# EAGLE design PCB_MULTI_PUMP (EAGLE 9.5.2)
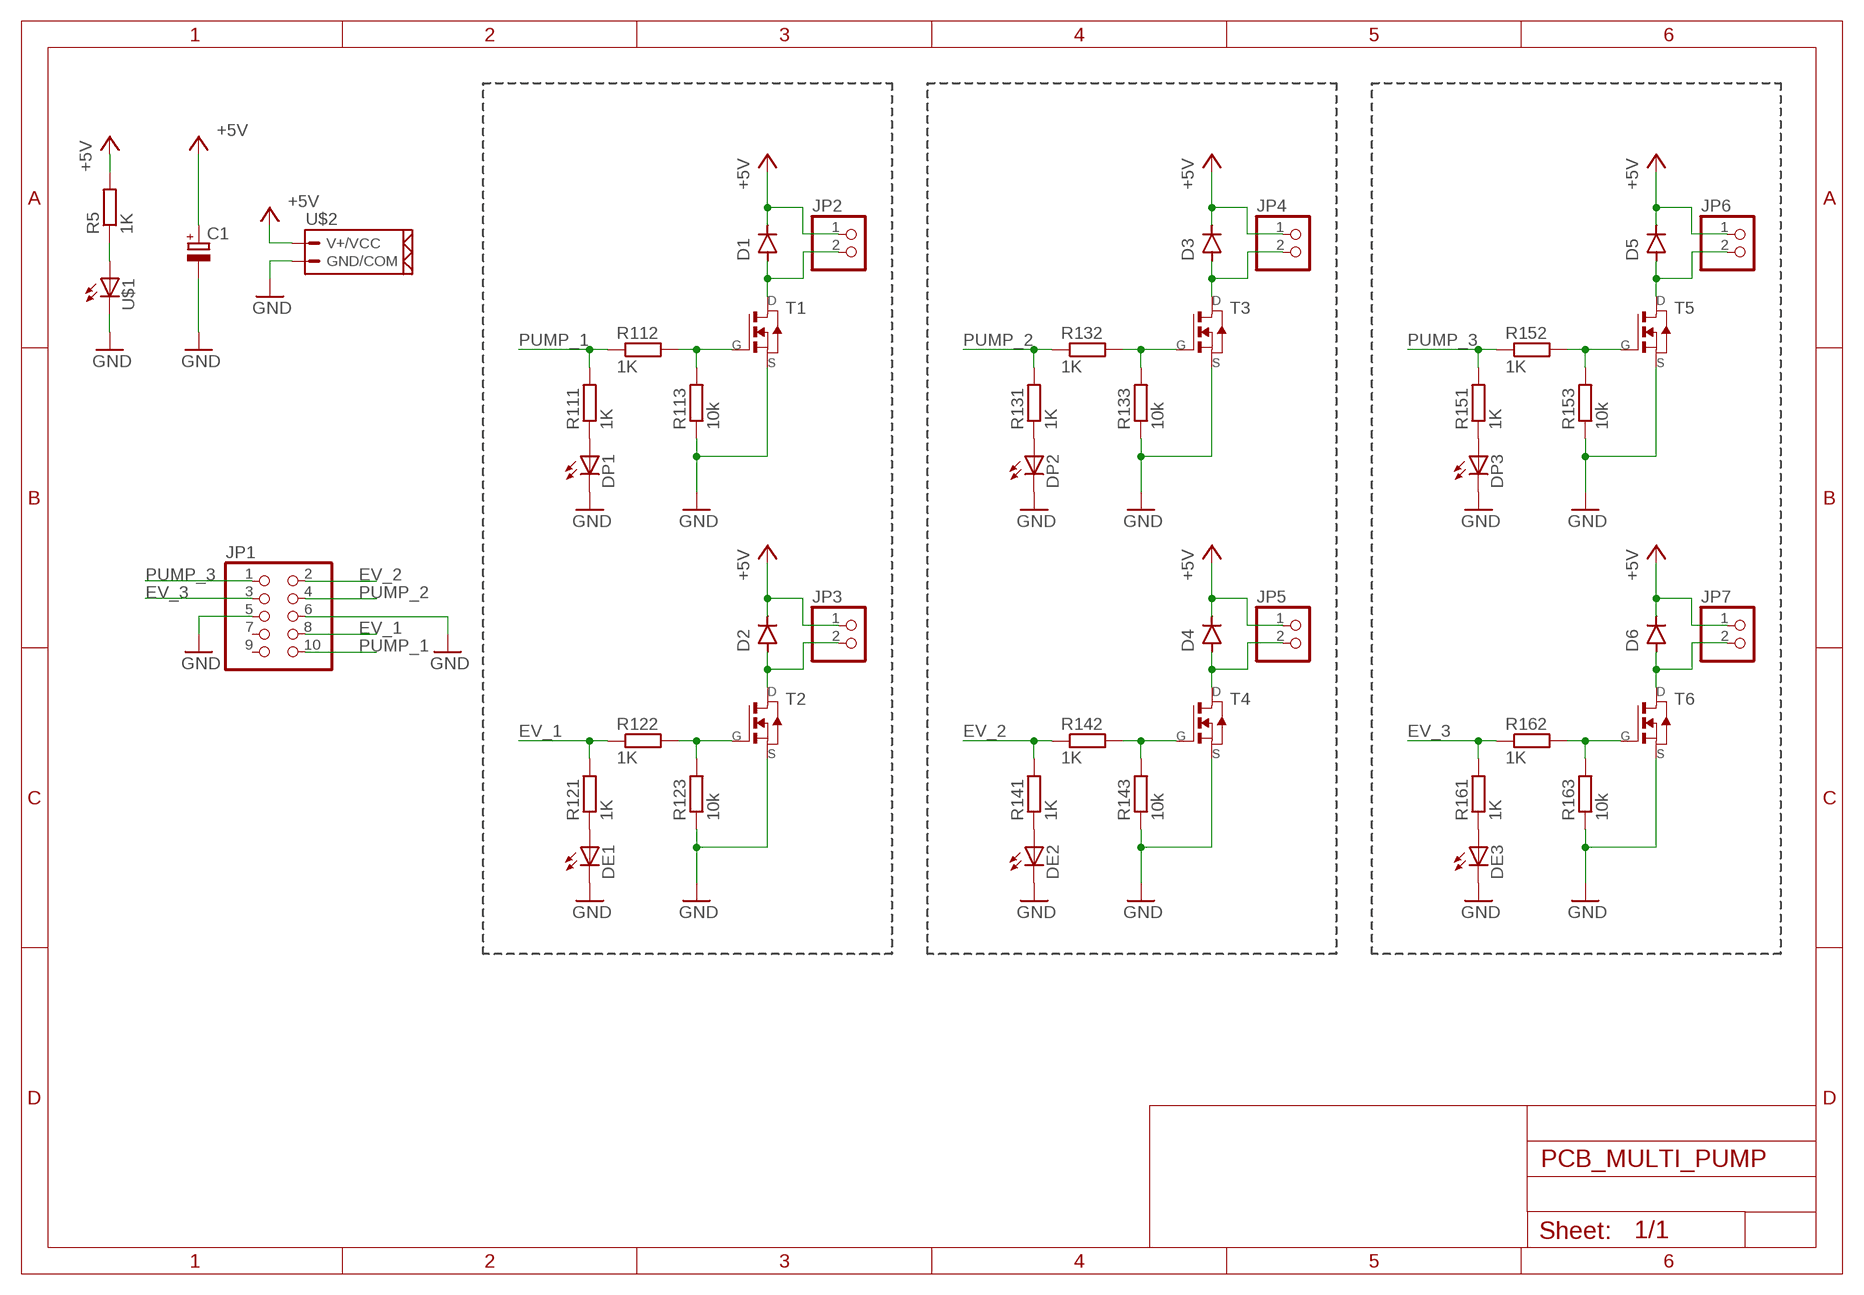
[diagram p0: schematic, sheet 1]

## Parts
C1  CPOL-EUE5-10.5  [E5-10,5]
D1  GF1  [SMA-DO214AC]
D2  GF1  [SMA-DO214AC]
D3  GF1  [SMA-DO214AC]
D4  GF1  [SMA-DO214AC]
D5  GF1  [SMA-DO214AC]
D6  GF1  [SMA-DO214AC]
DE1  LEDFAB1206  [LED1206FAB]
DE2  LEDFAB1206  [LED1206FAB]
DE3  LEDFAB1206  [LED1206FAB]
DP1  LEDFAB1206  [LED1206FAB]
DP2  LEDFAB1206  [LED1206FAB]
DP3  LEDFAB1206  [LED1206FAB]
JP1  PINHD-2X05_2.54-SMD  [2X05SMD]
JP2  PINHD-1X02_2.54-SMD-90°  [1X02SMD/90]
JP3  PINHD-1X02_2.54-SMD-90°  [1X02SMD/90]
JP4  PINHD-1X02_2.54-SMD-90°  [1X02SMD/90]
JP5  PINHD-1X02_2.54-SMD-90°  [1X02SMD/90]
JP6  PINHD-1X02_2.54-SMD-90°  [1X02SMD/90]
JP7  PINHD-1X02_2.54-SMD-90°  [1X02SMD/90]
R5  1K  R-EU_R1206  [R1206]
R111  1K  R-EU_R1206  [R1206]
R112  1K  R-EU_R1206  [R1206]
R113  10k  R-EU_R1206  [R1206]
R121  1K  R-EU_R1206  [R1206]
R122  1K  R-EU_R1206  [R1206]
R123  10k  R-EU_R1206  [R1206]
R131  1K  R-EU_R1206  [R1206]
R132  1K  R-EU_R1206  [R1206]
R133  10k  R-EU_R1206  [R1206]
R141  1K  R-EU_R1206  [R1206]
R142  1K  R-EU_R1206  [R1206]
R143  10k  R-EU_R1206  [R1206]
R151  1K  R-EU_R1206  [R1206]
R152  1K  R-EU_R1206  [R1206]
R153  10k  R-EU_R1206  [R1206]
R161  1K  R-EU_R1206  [R1206]
R162  1K  R-EU_R1206  [R1206]
R163  10k  R-EU_R1206  [R1206]
T1  NMOSFETSOT23  [SOT-23]
T2  NMOSFETSOT23  [SOT-23]
T3  NMOSFETSOT23  [SOT-23]
T4  NMOSFETSOT23  [SOT-23]
T5  NMOSFETSOT23  [SOT-23]
T6  NMOSFETSOT23  [SOT-23]
U$1  LEDFAB1206  [LED1206FAB]
U$2  CONN_02_PUI  [NSK396-2C]

## Nets
+5V: C1.+ D1.K(C) D2.K(C) D3.K(C) D4.K(C) D5.K(C) D6.K(C) JP2.1 JP3.1 JP4.1 JP5.1 JP6.1 JP7.1 R5.2 U$2.P$2(V+/VCC)
EV_1: JP1.8 R121.2 R122.1
EV_2: JP1.2 R141.2 R142.1
EV_3: JP1.3 R161.2 R162.1
GND: C1.- DE1.2(C) DE2.2(C) DE3.2(C) DP1.2(C) DP2.2(C) DP3.2(C) JP1.5 JP1.6 R113.1 R123.1 R133.1 R143.1 R153.1 R163.1 T1.2(S) T2.2(S) T3.2(S) T4.2(S) T5.2(S) T6.2(S) U$1.2(C) U$2.P$1(GND/COM)
N$1: D2.A JP3.2 T2.1(D)
N$2: D1.A JP2.2 T1.1(D)
N$3: R112.2 R113.2 T1.3(G)
N$4: R122.2 R123.2 T2.3(G)
N$5: R5.1 U$1.1(A)
N$6: DP1.1(A) R111.1
N$7: DE1.1(A) R121.1
N$8: D3.A JP4.2 T3.1(D)
N$9: R132.2 R133.2 T3.3(G)
N$10: D4.A JP5.2 T4.1(D)
N$11: R142.2 R143.2 T4.3(G)
N$12: DP2.1(A) R131.1
N$13: DE2.1(A) R141.1
N$14: D5.A JP6.2 T5.1(D)
N$15: R152.2 R153.2 T5.3(G)
N$16: D6.A JP7.2 T6.1(D)
N$17: R162.2 R163.2 T6.3(G)
N$18: DP3.1(A) R151.1
N$19: DE3.1(A) R161.1
PUMP_1: JP1.10 R111.2 R112.1
PUMP_2: JP1.4 R131.2 R132.1
PUMP_3: JP1.1 R151.2 R152.1
Unconnected: JP1.7 JP1.9

## Library data of the parts
C1 = rcl:CPOL-EU: POLARIZED CAPACITOR, European symbol; SPICEPREFIX: C
D1-D6 = diode:GF1: DIODE
DE1-DE3 DP1-DP3 U$1 = fab:LED: LED
JP1 = pinhead-2:PINHD-2X05: PIN HEADER
JP2-JP7 = pinhead-2:PINHD-1X02: PIN HEADER
R5 R111-R113 R121-R123 R131-R133 R141-R143 R151-R153 R161-R163 = rcl:R-EU_: RESISTOR, European symbol; SPICEPREFIX: R
T1-T6 = fab:NMOSFET: MOS FET
U$2 = OPENBOT:CONN_02_PUI

## Board
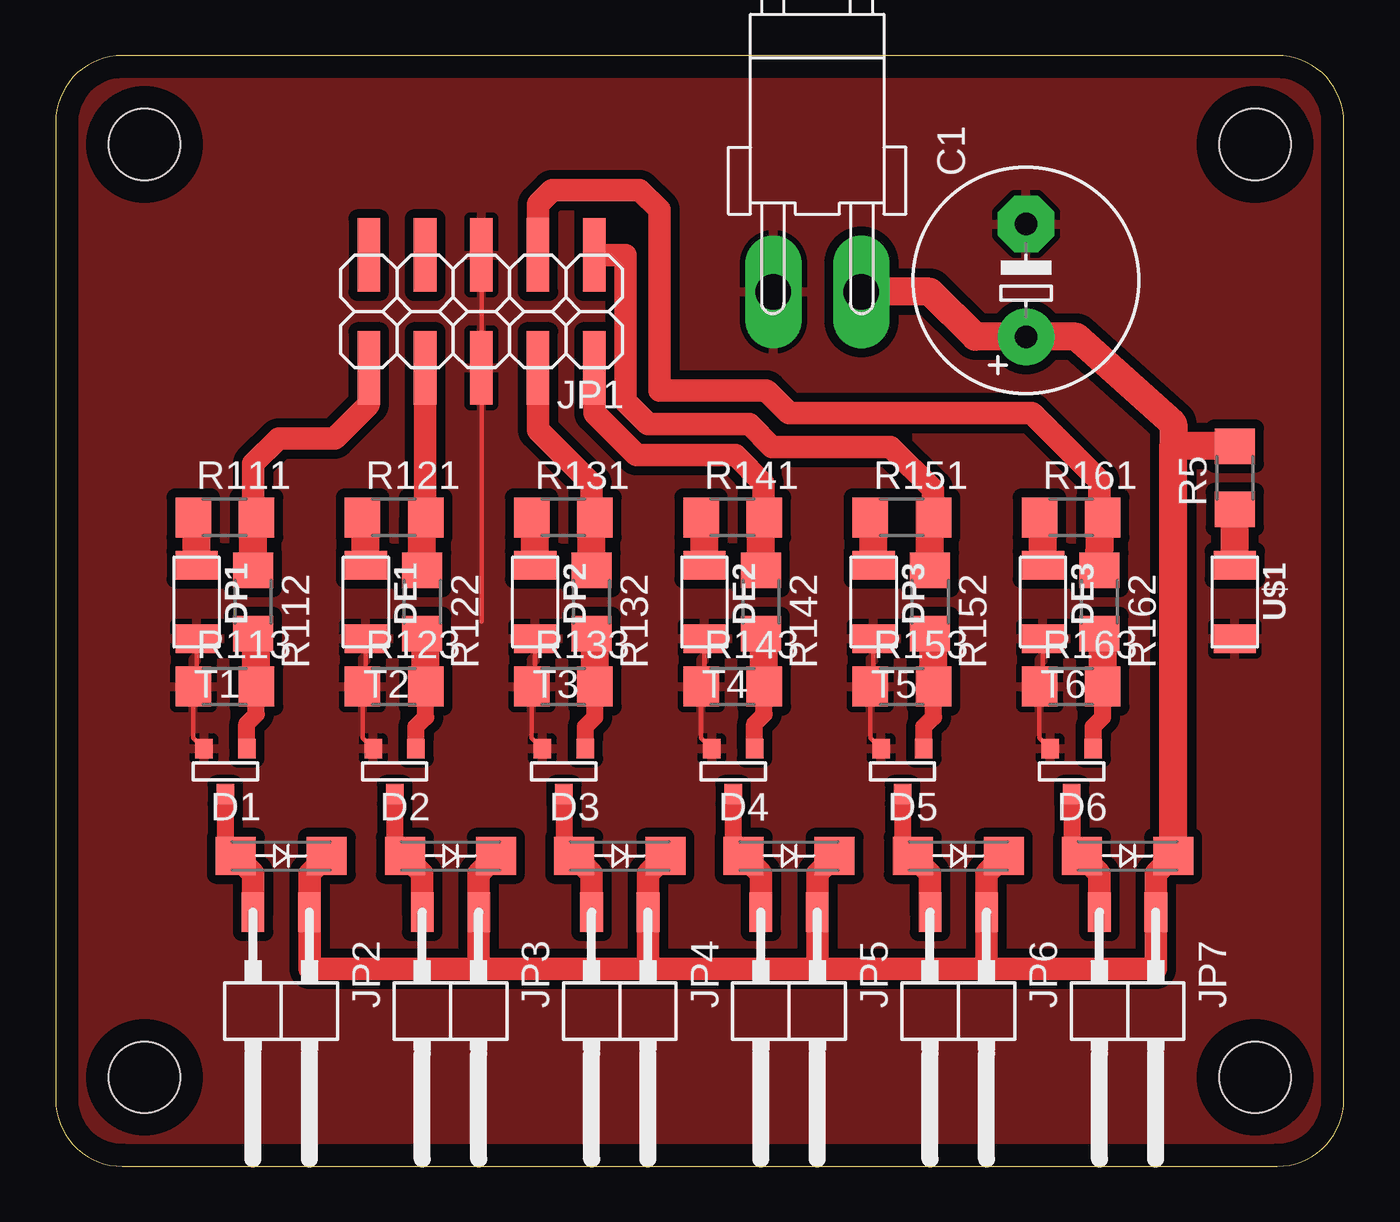
[diagram p1: board, top side]

Size 58 x 50 mm. Coordinates in mm from the lower left corner, seen from the top.
Outline: 0,47 0,3 arc90 3,0 55,0 arc90 58,3 58,47 arc90 55,50 3,50 arc90 0,47
Copper layers (1*16): Top 0.035mm / dielectric 1.5mm / Bottom 0.035mm
Design rules "default": minimum track width 6mil, minimum drill 0.35mm, track to track 6mil, track to pad 6mil, pad to pad 6mil, via to via 6mil, smd to smd 6mil, copper to edge 40mil, drill to drill 6mil, minimum pad ring 10mil, minimum via ring 8mil, stop-mask expansion 4mil, vias tented up to drill 0mil, thermal gap 10mil
Holes 3.2 mm at 4,46 4,4 54,4 54,46

### Footprints (pad centres in the part's own frame; a part is rotated, then mirrored left to right if it is on the bottom)
E5-10,5 = drill 1.016 pad 2.54: + -2.54,0 | drill 1.016 pad 2.54 octagon: - 2.54,0
SMA-DO214AC = smd 1.8 x 1.7: A -2.05,0; K 2.05,0
LED1206FAB = smd 1.27 x 1.905: 1 -1.651,0; 2 1.651,0
2X05SMD = smd 1.016 x 3.302: 1 -1.27,-3.81; 2 -1.27,1.27; 3 1.27,-3.81; 4 1.27,1.27; 5 3.81,-3.81; 6 3.81,1.27; 7 6.35,-3.81; 8 6.35,1.27; 9 8.89,-3.81; 10 8.89,1.27
1X02SMD/90 = smd 1.016 x 1.778: 1 -1.27,-5.08; 2 1.27,-5.08
R1206 = smd 1.6 x 1.803: 1 -1.422,0; 2 1.422,0
SOT-23 = smd 0.787 x 0.889: 1 0.025,-1.016; 2 -0.94,1.016; 3 0.991,1.016
NSK396-2C = drill 1.6 pad 2.54 long: P$1 -1.98,0; P$2 1.98,0

### Placement (x,y rotation side)
C1  43.69,39.88 90 top
D1  10.16,13.97 0 top
D2  17.78,13.97 0 top
D3  25.4,13.97 0 top
D4  33.02,13.97 0 top
D5  40.64,13.97 0 top
D6  48.26,13.97 0 top
DE1  13.97,25.4 270 top
DE2  29.21,25.4 270 top
DE3  44.45,25.4 270 top
DP1  6.35,25.4 270 top
DP2  21.59,25.4 270 top
DP3  36.83,25.4 270 top
JP1  22.99,37.21 180 top
JP2  10.16,6.35 180 top
JP3  17.78,6.35 180 top
JP4  25.4,6.35 180 top
JP5  33.02,6.35 180 top
JP6  40.64,6.35 180 top
JP7  48.26,6.35 180 top
R5  53.09,30.99 90 top
R111  7.62,29.21 0 top
R112  8.89,25.4 270 top
R113  7.62,21.59 0 top
R121  15.24,29.21 0 top
R122  16.51,25.4 270 top
R123  15.24,21.59 0 top
R131  22.86,29.21 0 top
R132  24.13,25.4 270 top
R133  22.86,21.59 0 top
R141  30.48,29.21 0 top
R142  31.75,25.4 270 top
R143  30.48,21.59 0 top
R151  38.1,29.21 0 top
R152  39.37,25.4 270 top
R153  38.1,21.59 0 top
R161  45.72,29.21 0 top
R162  46.99,25.4 270 top
R163  45.72,21.59 0 top
T1  7.62,17.78 0 top
T2  15.24,17.78 0 top
T3  22.86,17.78 0 top
T4  30.48,17.78 0 top
T5  38.1,17.78 0 top
T6  45.72,17.78 0 top
U$1  53.09,25.4 270 top
U$2  34.29,39.37 0 top

### Tracks (layer width: path | path; a pad name or v marks a point on that pad's centre or on a via)
+5V
  Top 1.016: 41.91,8.89 49.53,8.89 JP7.1 49.53,13.19 D6.K | 41.91,8.89 34.29,8.89 | 34.29,8.89 26.67,8.89 | 26.67,8.89 19.05,8.89 | 19.05,8.89 JP3.1 19.05,13.19 D2.K | 26.67,8.89 JP4.1 26.67,13.19 D3.K | 34.29,8.89 JP5.1 34.29,13.19 D4.K | 41.91,8.89 JP6.1 41.91,13.19 D5.K | 19.05,8.89 11.43,8.89 JP2.1 11.43,13.19 D1.K
  Top 1.27: D6.K 50.31,32.41 | R5.2 50.31,32.41 | 50.31,32.41 50.31,33.42 45.96,37.34 C1.+ 41.4,37.34 39.37,39.37 U$2.P$2
EV_1
  Top 1.016: JP1.8 16.64,29.18
  Top 1.27: R122.1 16.51,29.06 16.64,29.18 R121.2
EV_2
  Top 1.016: JP1.2 24.26,33.91 26.16,32 30.61,32 31.88,30.73 31.88,29.18 31.75,29.06
  Top 1.27: R142.1 31.75,29.06 R141.2
EV_3
  Top 1.016: JP1.3 21.72,43.31 22.35,43.94 26.29,43.94 27.18,43.05 27.18,34.92 32,34.92 33.02,33.91 43.94,33.91 46.99,30.86 46.99,27.79
  Top 1.27: R162.1 46.99,27.79 46.99,29.06 R161.2
GND
  Top 0.203: T1.2 6.2,19.28 R113.1 6.35,21.74 DP1.2 | DE1.2 13.97,21.74 R123.1 13.82,19.28 T2.2 | DP2.2 21.59,21.74 R133.1 21.44,19.28 T3.2 | DE2.2 29.21,21.74 R143.1 29.06,19.28 T4.2 | DP3.2 36.83,21.74 R153.1 36.68,19.28 T5.2 | DE3.2 44.45,21.74 R163.1 44.3,19.28 T6.2 | 19.18,24.51 JP1.6 JP1.5
  pour Top (isolate 0.406): -1.27,50.8 101.6,50.8 101.6,-1.27 -1.27,-1.27
N$1
  Top 0.762: T2.1 15.27,14.44 D2.A
  Top 1.016: JP3.2 16.51,13.19 D2.A
N$2
  Top 0.762: T1.1 7.64,14.44 D1.A
  Top 1.016: JP2.2 8.89,13.19 D1.A
N$3
  Top 0.762: T1.3 8.61,19.91 9.04,20.34 R113.2
  Top 1.27: R113.2 9.04,23.83 R112.2
N$4
  Top 0.762: T2.3 16.23,19.79 16.66,20.22 R123.2
  Top 1.27: R123.2 16.66,23.83 R122.2
N$5
  Top 1.27: U$1.1 R5.1
N$6
  Top 1.27: DP1.1 6.35,29.06 R111.1
N$7
  Top 1.27: DE1.1 13.97,29.06 R121.1
N$8
  Top 0.762: T3.1 22.89,14.44 D3.A
  Top 1.016: JP4.2 24.13,13.19 D3.A
N$9
  Top 0.762: T3.3 23.85,19.79 24.28,20.22 R133.2
  Top 1.27: R133.2 24.28,23.83 R132.2
N$10
  Top 0.762: T4.1 30.5,14.44 D4.A
  Top 1.016: JP5.2 31.75,13.19 D4.A
N$11
  Top 0.762: T4.3 31.47,19.91 31.9,20.34 R143.2
  Top 1.27: R143.2 31.9,23.83 R142.2
N$12
  Top 1.27: DP2.1 21.59,29.06 R131.1
N$13
  Top 1.27: DE2.1 29.21,29.06 R141.1
N$14
  Top 0.762: T5.1 38.12,14.44 D5.A
  Top 1.016: JP6.2 39.37,13.19 D5.A
N$15
  Top 0.762: T5.3 39.09,19.79 39.52,20.22 R153.2
  Top 1.27: R153.2 39.52,23.83 R152.2
N$16
  Top 0.762: T6.1 45.74,14.44 D6.A
  Top 1.016: JP7.2 46.99,13.19 D6.A
N$17
  Top 0.762: T6.3 46.71,19.79 47.14,20.22 R163.2
  Top 1.27: R163.2 47.14,23.83 R162.2
N$18
  Top 1.27: DP3.1 36.83,29.06 R151.1
N$19
  Top 1.27: DE3.1 44.45,29.06 R161.1
PUMP_1
  Top 1.016: JP1.10 14.1,34.29 12.57,32.77 10.03,32.77 8.89,31.62 8.89,29.06
  Top 1.27: R112.1 8.89,29.06 R111.2
PUMP_2
  Top 1.016: R131.2 24.13,29.36 24.13,30.73 21.72,33.15 JP1.4
  Top 1.27: R132.1 24.13,29.06 R131.2
PUMP_3
  Top 1.016: JP1.1 25.65,41.02 25.65,34.42 26.67,33.4 31.24,33.4 32.26,32.38 37.59,32.38 39.5,30.48 39.5,29.18 39.37,29.06
  Top 1.27: R152.1 39.37,29.06 R151.2